# Altium schematic sheet Schema.SchDoc
size 420 x 297 mm; SheetNumber: 1; SheetTotal: 1
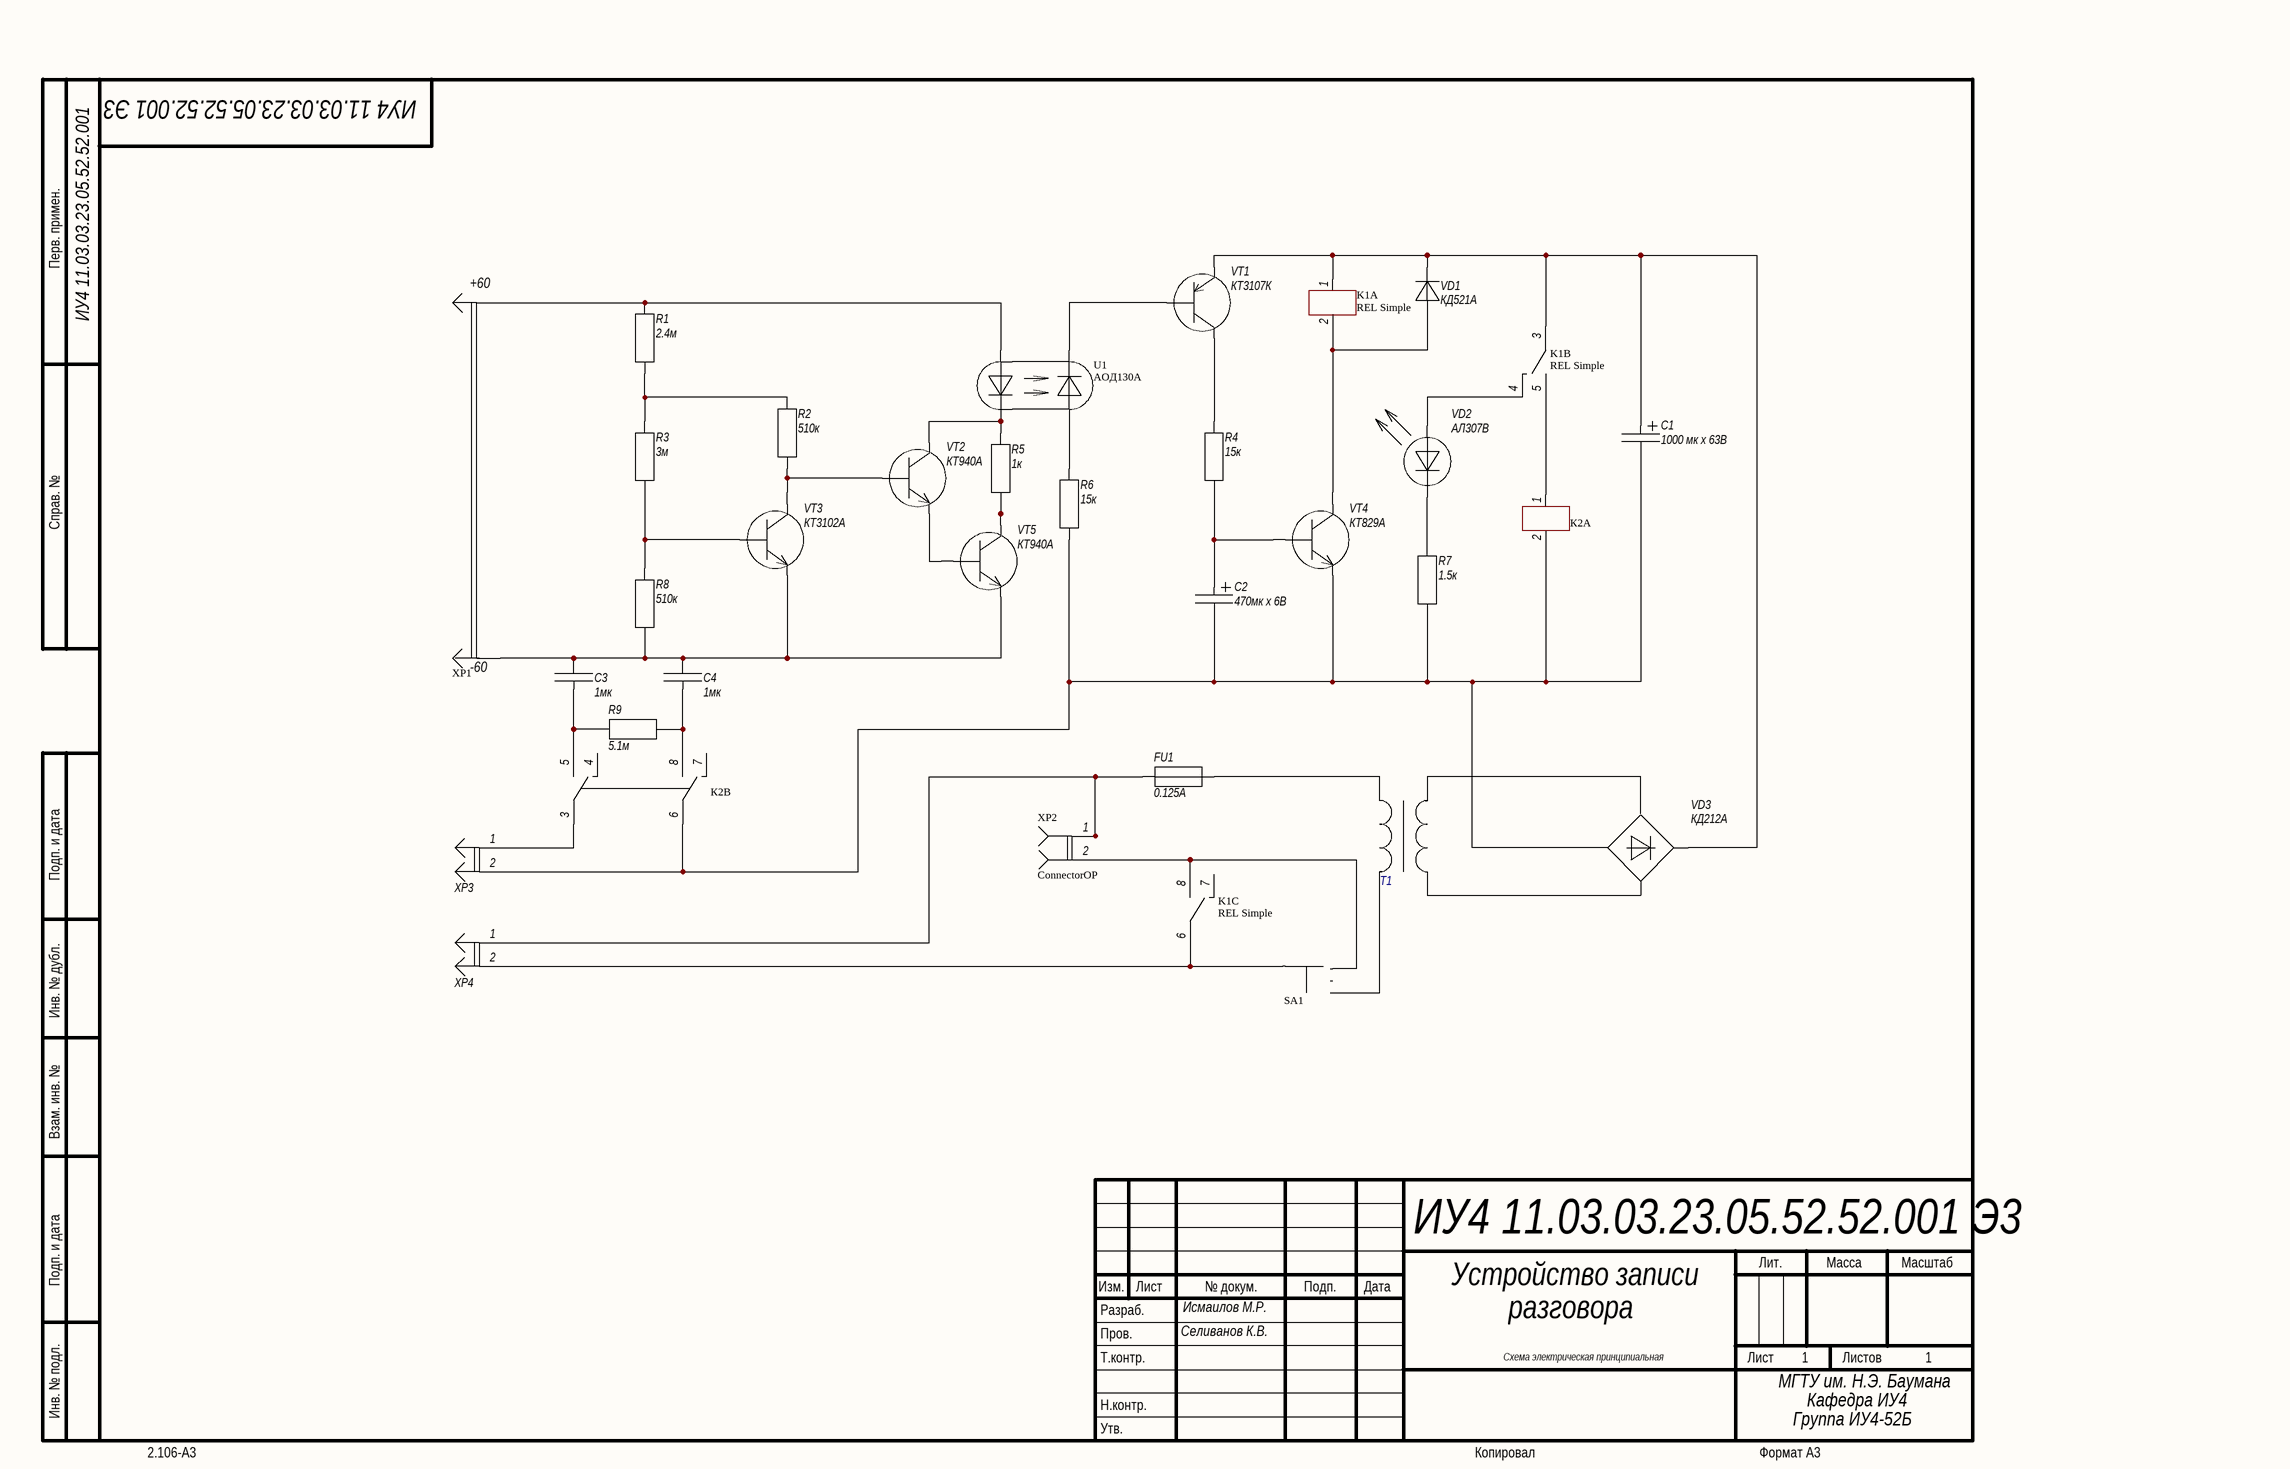
[diagram p0: Schema.SchDoc]

## Parts
C1  1000 мк х 63В  [CAPPR1000-2300X4200]
C2  470мк х 6В  [CAPPR1000-3600X5200]
C3  1мк  [CAPRB_MURATA_DEBE33D103ZA3B]
C4  1мк  [CAPRB_MURATA_DEBE33D103ZA3B]
FU1  0.125А  [FUSH_SCHURTER_OGN]
K1  REL Simple  [USSR relay]  (parts A,B,C of 3)
R1  2.4м  [RES2032-1400X350]
R2  510к  [RES2032-1400X350]
R3  3м  [RES2032-1400X350]
R4  15к  [RES2032-1400X350]
R5  1к  [RES2032-1400X350]
R6  15к  [RES2032-1400X350]
R7  1.5к  [RES2032-1400X350]
R8  510к  [RES2032-1400X350]
R9  5.1м  [RES2032-1400X350]
SA1  3-positoin switch  [SW_NR01103ANG13-1C]  (value not drawn)
T1  (no value)
U1  АОД130А  [DIP1016W50P254L458H480Q4]
VD1  КД521А  [DO-35]
VD2  АЛ307В  [LED_3MM_GREEN_1C-2A]
VD3  КД212А  [DIOB_GBJ2506]
VT1  КТ3107К  [TO-92AA-P152]
VT2  КТ940А  [TO-126-v]
VT3  КТ3102А  [TO-18]
VT4  КТ829А  [TO-92AA-P152]
VT5  КТ940А  [TO-126-v]
XP1  Connector2-long  [PHOENIX_1715721]  (value not drawn)
XP2  ConnectorOP  [PHOENIX_1715721]
XP3  (no value)  [PHOENIX_1715721]
XP4  (no value)  [PHOENIX_1715721]
К2  Rel2connected  [USSR relay]  (value not drawn)  (parts A,B of 2)

## Nets
NetC1_1: C1.1 K1.1 K1.3 VD1.2(C) VD3.1 VT1.1
NetC1_2: C1.2 C2.2 R6.2 R7.2 VD3.4 VT4.1 XP3.2 К2.2 К2.6
NetC2_1: C2.1 R4.2 VT4.2
NetC3_1: C3.1 R9.2 К2.5
NetC3_2: C3.2 C4.2 R8.2 VT3.1 VT5.3 XP1.2(+60)
NetC4_1: C4.1 R9.1 К2.8
NetFU1_1: FU1.1 XP2.1 XP4.1
NetFU1_2: FU1.2 T1.2
NetK1_2: K1.2 VD1.1(A) VT4.3
NetK1_4: K1.4 VD2.1(A)
NetK1_5: K1.5 К2.1
NetK1_6: K1.6 SA1.1 XP4.2
NetK1_8: K1.8 SA1.2 XP2.2
NetR1_1: R1.1 U1.4 XP1.1(-60)
NetR1_2: R1.2 R2.1 R3.1
NetR2_2: R2.2 VT2.2 VT3.3
NetR3_2: R3.2 R8.1 VT3.2
NetR4_1: R4.1 VT1.3
NetR5_1: R5.1 U1.1 VT2.1
NetR5_2: R5.2 VT5.1
NetR6_1: R6.1 U1.2
NetR7_1: R7.1 VD2.2(C)
NetSA1_4: SA1.4 T1.1
NetT1_3: T1.3 VD3.3
NetT1_4: T1.4 VD3.2
NetU1_3: U1.3 VT1.2
NetVT2_3: VT2.3 VT5.2
NetXP3_1: XP3.1 К2.3

Not connected (* = marked no-connect by the designer): K1 7; SA1 3(2); К2 4(12) 7(12)

## Notes on the sheet
- ИУ4 11.03.03.23.05.52.52.001 Э3
- ИУ4 11.03.03.23.05.52.52.001
- (near XP1) +60
- (near XP1) -60
- Устройство записи
- Селиванов К.В.
- Исмаилов М.Р.
- Схема электрическая принципиальная
- разговора
- МГТУ им. Н.Э. Баумана
- Группа ИУ4-52Б
- Кафедра ИУ4
- Перв. примен.
- Справ. №
- Подп. и дата
- Инв. № дубл.
- Взам. инв. №
- Разраб.
- Изм.
- Лист
- № докум.
- Подп.
- Дата
- Лит.
- Масса
- Масштаб
- Пров.
- Т.контр.
- Листов
- Инв. № подл.
- Утв.
- Н.контр.
- 2.106-A3
- Копировал
- Формат А3

## Library data of the parts
C1 = CapPol 1000 мк х 63В: Наименование: К50-35 Конденсатор электролитический 1000 мкФ 63В 105*С
C2 = CapPol 470мк х 6В: Наименование: К50-35 Конденсатор электролитический 470 мкФ 6В 105*С
C3 C4 = Cap: Наименование: Конденсатор дисковый 1 мкФ 25В +80-20%
FU1 = Fuse 0.125А: Наименование: Патрон плавкого предохранителя OGN Fuse Holder 0031.8201 10 А
K1 = REL Simple: Наименование: Реле электромагнитное РЭС9 27В
R1 = res 2.4м 2Вт: Наименование: KNP-200 Резистор 2,4 МОм 2Вт ±5%
R2 R8 = res 510к 2Вт: НАименование: KNP-200 Резистор 510 кОм 2Вт ±5%
R3 = res 3м 2Вт: Наименование: KNP-200 Резистор 1 кОм 2Вт ±5%
R4 R6 = res 15к 2Вт: Наименование: KNP-200 Резистор 15 кОм 2Вт ±5%
R5 = res 1к 2Вт: Наименование: KNP-200 Резистор 1 кОм 2Вт ±5%
R7 = res 1.5к 2Вт: Наименование: KNP-200 Резистор 1,5 кОм 2Вт ±5%
R9 = res 5.1м 2Вт: Наименование: KNP-200 Резистор 5,1 МОм 2Вт ±5%
SA1 = 3-positoin switch: Наименование: 3-х позиционный переключатель NR01103ANG13-1C
T1 = TRANSFORMATOR-2: Наименование: Трансформатор силовой 12В, 28Вт
U1 = opt АОД130А: Наименование: Оптопара АОД130А
VD1 = DIODE КД521А: Наименование: Диод КД521А 100В 50 мА
VD2 = LED АЛ307В: Наименование: Светодиод АЛ307ВМ 2В 20 мА
VD3 = BRIDGE: Наименование: Диодный мост GBJ2506-F 600В 25А
VT1 = КТ3107К: Наименование: Транзистор КТ3107К
VT2 VT5 = КТ940А: Наименование: Транзистор КТ940А
VT3 = КТ3102А: Наименование: Транзистор КТ3102А
VT4 = КТ829А: Наименование: Транзистор КТ 829А
XP1 = Connector Long: Наименование: Клеммник винтовой MKDS 1,5/ 2-5,08
XP2 = ConnectorOP: Наименование: Клеммник винтовой MKDS 1,5/ 2-5,08
XP3 XP4 = Connector Classic: Наименование: Клеммник винтовой MKDS 1,5/ 2-5,08
К2 = Rel2connected: Наименование: Реле электромагнитное РЭС9 27В